# Altium schematic sheet Sheet_1_2022-10-19.schdoc
size 166 x 147 mm
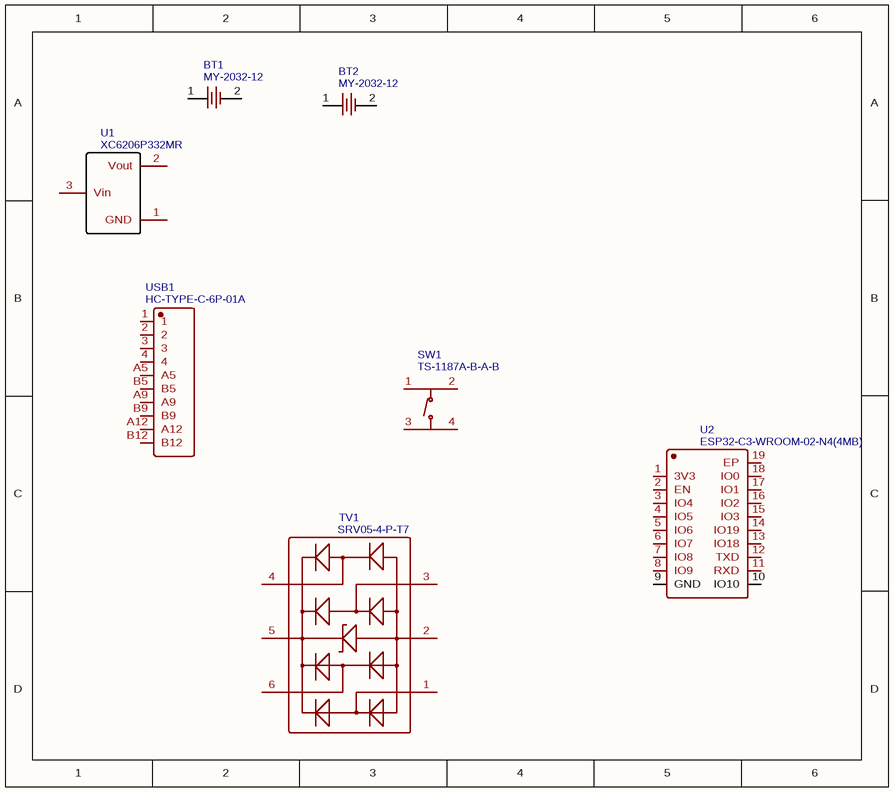
[diagram p0: Sheet_1_2022-10-19.schdoc]

## Parts
BT1  MY-2032-12  [BAT-SMD_MY-2032-12]
BT2  MY-2032-12  [BAT-SMD_MY-2032-12]
SW1  TS-1187A-B-A-B  [SW-SMD_4P-L5.1-W5.1-P3.70-LS6.5-TL-2]
TV1  SRV05-4-P-T7  [SOT-23-6_L2.9-W1.6-P0.95-LS2.8-BR]
U1  XC6206P332MR  [SOT-23-3_L2.9-W1.6-P1.90-LS2.8-BR]
U2  ESP32-C3-WROOM-02-N4(4MB)  [BULETM-SMD_ESPRESSIF_ESP32-C3-WROOM-02-N4-4MB]
USB1  HC-TYPE-C-6P-01A  [USB-C-SMD_HC-TYPE-C-6P-01A]

## Nets

Not connected (* = marked no-connect by the designer): BT1 1 2; BT2 1 2; SW1 1(A) 2(B) 3(C) 4(D); TV1 1 2 3 4 5 6; U1 1(GND) 2(Vout) 3(Vin); U2 1(3V3) 2(EN) 3(IO4) 4(IO5) 5(IO6) 6(IO7) 7(IO8) 8(IO9) 9(GND) 10(IO10) 11(RXD) 12(TXD) 13(IO18) 14(IO19) 15(IO3) 16(IO2) 17(IO1) 18(IO0) 19(EP); USB1 1 2 3 4 A5 A9 A12 B5 B9 B12

## Library data of the parts
BT1 BT2 = MY-2032-12: BOM_Manufacturer: MYOUNG(美阳); Contributor: LCSC; BOM_Supplier: LCSC; BOM_Supplier Part: C964833; BOM_Manufacturer Part: MY-2032-12; BOM_JLCPCB Part Class: Extended Part; spicePre: B; spiceSymbolName: MY-2032-12
SW1 = TS-1187A-B-A-B: BOM_Manufacturer: XKB Enterprise; Contributor: LCSC; BOM_Supplier: LCSC; BOM_Supplier Part: C318884; BOM_Manufacturer Part: TS-1187A-B-A-B; BOM_JLCPCB Part Class: Basic Part; spicePre: S; spiceSymbolName: TS-1187A-B-A-B
TV1 = SRV05-4-P-T7: BOM_Manufacturer: PROTEK; BOM_Supplier: LCSC; BOM_Manufacturer Part: SRV05-4-P-T7; BOM_Supplier Part: C85364; BOM_JLCPCB Part Class: Basic Part; spicePre: T; spiceSymbolName: SRV05-4-P-T7
U1 = XC6206P332MR: BOM_Manufacturer: TOREX; subpart_no: 1; BOM_Supplier: LCSC; BOM_Manufacturer Part: XC6206P332MR; BOM_Supplier Part: C5446; BOM_JLCPCB Part Class: Basic Part; spicePre: U; spiceSymbolName: XC6206P332MR
U2 = ESP32-C3-WROOM-02-N4(4MB): BOM_Manufacturer: ESPRESSIF 乐鑫; Contributor: LCSC; BOM_Supplier: LCSC; BOM_Supplier Part: C2934560; BOM_Manufacturer Part: ESP32-C3-WROOM-02-N4(4MB); BOM_JLCPCB Part Class: Extended Part; spicePre: U; spiceSymbolName: ESP32-C3-WROOM-02-N4(4MB)
USB1 = HC-TYPE-C-6P-01A: BOM_Manufacturer: HCTL(华灿天禄); Contributor: LCSC; BOM_Supplier: LCSC; BOM_Supplier Part: C2894893; BOM_Manufacturer Part: HC-TYPE-C-6P-01A; BOM_JLCPCB Part Class: Extended Part; spicePre: U; spiceSymbolName: HC-TYPE-C-6P-01A